# Altium schematic sheet CP2102N.SchDoc
size A3; SheetNumber: 3; SheetTotal: 7
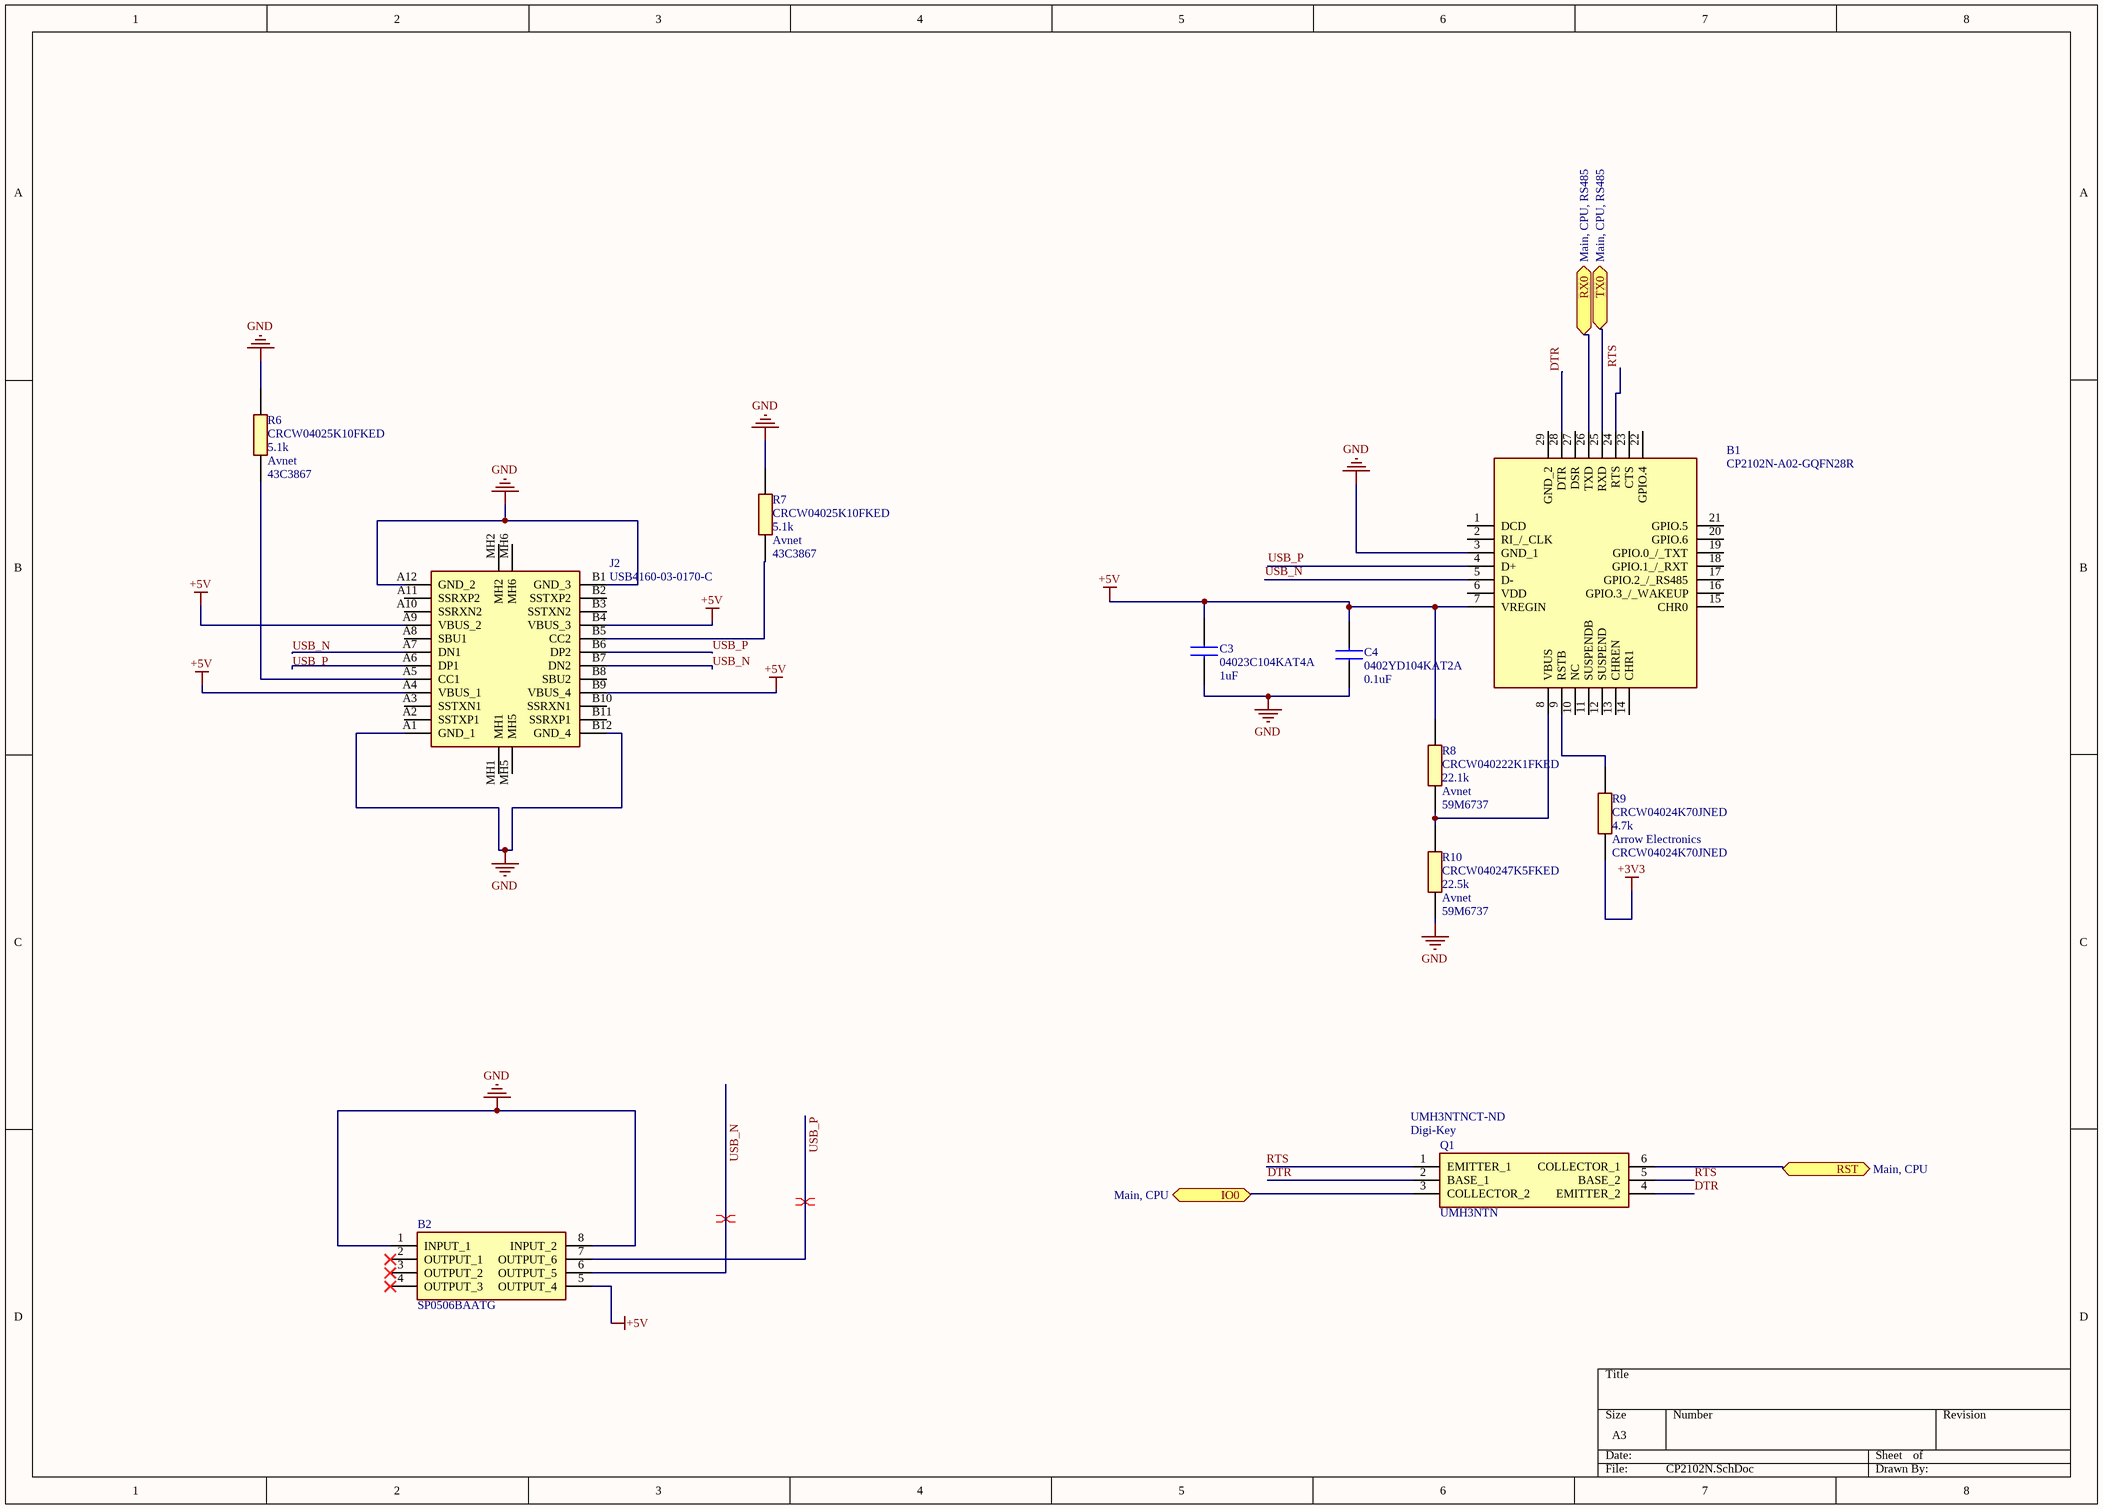
[diagram p0: CP2102N.SchDoc]

## Parts
B1  CP2102N-A02-GQFN28R  [QFN50P500X500X80-29N-D]
B2  SP0506BAATG  [SOP65P488X117-8N]
C3  04023C104KAT4A  value 1uF  [CAPC1005X40N]
C4  0402YD104KAT2A  value 0.1uF  [CAPC1005X40N]
J2  USB4160-03-0170-C  [USB4160030170C]
Q1  UMH3NTN  Supplier 1: Digi-Key  Supplier Part Number 1: UMH3NTNCT-ND  [UMH3NTN]
R6  CRCW04025K10FKED  value 5.1k  Supplier 1: Avnet  Supplier Part Number 1: 43C3867  [RESC1005X40N]
R7  CRCW04025K10FKED  value 5.1k  Supplier 1: Avnet  Supplier Part Number 1: 43C3867  [RESC1005X40N]
R8  CRCW040222K1FKED  value 22.1k  Supplier 1: Avnet  Supplier Part Number 1: 59M6737  [RESC1005X40N]
R9  CRCW04024K70JNED  value 4.7k  Supplier 1: Arrow Electronics  [RESC1005X40N]
R10  CRCW040247K5FKED  value 22.5k  Supplier 1: Avnet  Supplier Part Number 1: 59M6737  [RESC1005X40N]

## Ports
IO0 (bidir, see Main, CPU), RST (bidir, see Main, CPU), RX0 (bidir, see Main, CPU, RS485), TX0 (bidir, see Main, CPU, RS485)

## Nets
+3V3: R9.1
+5V: B1.7(VREGIN) B2.5(OUTPUT_4) C3.2 C4.2 J2.A4(VBUS_1) J2.A9(VBUS_2) J2.B4(VBUS_3) J2.B9(VBUS_4) R8.2
GND: B1.3(GND_1) B2.1(INPUT_1) B2.8(INPUT_2) C3.1 C4.1 J2.A1(GND_1) J2.A12(GND_2) J2.B1(GND_3) J2.B12(GND_4) R6.2 R7.2 R10.1
DTR: B1.28(DTR) Q1.2(BASE_1) Q1.4(EMITTER_2)
IO0: Q1.3(COLLECTOR_2) ; port IO0
RST: Q1.6(COLLECTOR_1) ; port RST
RTS: B1.24(RTS) Q1.1(EMITTER_1) Q1.5(BASE_2)
RX0: B1.26(TXD) ; port RX0
TX0: B1.25(RXD) ; port TX0
USB_N: B1.5(D-) B2.6(OUTPUT_5) J2.A7(DN1) J2.B7(DN2)
USB_P: B1.4(D+) B2.7(OUTPUT_6) J2.A6(DP1) J2.B6(DP2)
NetB1_8: B1.8(VBUS) R8.1 R10.2
NetB1_9: B1.9(RSTB) R9.2
NetJ2_A5: J2.A5(CC1) R6.1
NetJ2_B5: J2.B5(CC2) R7.1

Not connected (* = marked no-connect by the designer): B1 1(DCD) 2(RI_/_CLK) 6(VDD) 10(NC) 11(SUSPENDB) 12(SUSPEND) 13(CHREN) 14(CHR1) 15(CHR0) 16(GPIO.3_/_WAKEUP) 17(GPIO.2_/_RS485) 18(GPIO.1_/_RXT) 19(GPIO.0_/_TXT) 20(GPIO.6) 21(GPIO.5) 22(GPIO.4) 23(CTS) 27(DSR) 29(GND_2); B2 2(OUTPUT_1)* 3(OUTPUT_2)* 4(OUTPUT_3)*; J2 A2(SSTXP1) A3(SSTXN1) A8(SBU1) A10(SSRXN2) A11(SSRXP2) B2(SSTXP2) B3(SSTXN2) B8(SBU2) B10(SSRXN1) B11(SSRXP1) MH1 MH2 MH5 MH6

## Layout directives
differential pair: USB_N, USB_P

## Library data of the parts
B1 = CP2102N-A02-GQFN28R: USB Interface IC USB to UART bridge - QFN28; Manufacturer_Name: Silicon Labs; Geometry.Height: 0.8mm; Manufacturer_Part_Number: CP2102N-A02-GQFN28R; Mouser Part Number: 634-CP2102NA02QFN28R; Mouser Price/Stock: https://www.mouser.co.uk/ProductDetail/Silicon-Labs/CP2102N-A02-GQFN28R?qs=u16ybLDytRag4qKvSH3fTw%3D%3D; Arrow Part Number: CP2102N-A02-GQFN28R; Arrow Price/Stock: https://www.arrow.com/en/products/cp2102n-a02-gqfn28r/silicon-labs?region=nac; Datasheet Link: https://www.silabs.com/documents/public/data-sheets/cp2102n-datasheet.pdf
B2 = SP0506BAATG: TVS Diode Arrays; Manufacturer_Name: LITTELFUSE; Geometry.Height: 1.17mm; Mouser Part Number: 576-SP0506BAATG; Mouser Price/Stock: https://www.mouser.co.uk/ProductDetail/Littelfuse/SP0506BAATG?qs=RnOBYWd%2Fz7c6KTUitxDieg%3D%3D; Manufacturer_Part_Number: SP0506BAATG; Datasheet Link: https://www.littelfuse.com/~/media/electronics/datasheets/tvs_diode_arrays/littelfuse_tvs_diode_array_sp05_datasheet.pdf.pdf; Supplier 1: Arrow Electronics; Supplier Part Number 1: SP0506BAATG
C3 = 04023C104KAT4A: Multilayer Ceramic Capacitors MLCC - SMD/SMT 25V .1uF X7R 0402; Manufacturer_Name: AVX; Geometry.Height: 0.56mm; Mouser Part Number: 581-04023C104KAT4A; Mouser Price/Stock: https://www.mouser.co.uk/ProductDetail/AVX/0402YD104KAT2A?qs=fS3i9m8Z%2FmrV7G1UZb6Y7g%3D%3D; Manufacturer_Part_Number: 04023C104KAT4A; Datasheet Link: *; Supplier Part Number 1: 0402YD104KAT2A; Supplier 1: Avnet
C4 = 0402YD104KAT2A: Capacitor MLCC 0402 100nF 16V AVX 0402 Standard 100nF Ceramic Multilayer Capacitor, 16 V dc, +85C, X5R Dielectric, +/-10% SMD; Geometry.Height: 0.56mm; Mouser Part Number: 581-0402YD104K; Mouser Price/Stock: https://www.mouser.co.uk/ProductDetail/AVX/0402YD104KAT2A?qs=fS3i9m8Z%2FmrV7G1UZb6Y7g%3D%3D; Manufacturer_Name: AVX; Manufacturer_Part_Number: 0402YD104KAT2A; Datasheet Link: *; Supplier Part Number 1: 0402YD104KAT2A; Supplier 1: Avnet
J2 = USB4160-03-0170-C: USB Connectors USB-C Rec 3u" Vert 24P SMT 1.7mm TH stakes H7.46mm T+R+Cap; Manufacturer_Name: GCT (GLOBAL CONNECTOR TECHNOLOGY); Geometry.Height: 7.66mm; Mouser Part Number: 640-USB4160-3-0170-C; Mouser Price/Stock: https://www.mouser.co.uk/ProductDetail/GCT/USB4160-03-0170-C?qs=vvQtp7zwQdMCGQNngnxScA%3D%3D; Manufacturer_Part_Number: USB4160-03-0170-C; Datasheet Link: https://gct.co/Files/Drawings/USB4160.pdf?v=75f6cea7-84cd-41d4-89e8-137dc7b10777
Q1 = UMH3NTN: Bipolar Transistors - Pre-Biased DUAL NPN 50V 100MA SOT-363; Manufacturer_Name: ROHM Semiconductor; Geometry.Height: 1mm; Mouser Part Number: 755-UMH3NTN; Mouser Price/Stock: https://www.mouser.co.uk/ProductDetail/ROHM-Semiconductor/UMH3NTN?qs=4kLU8WoGk0st6ahJ6z2bmw%3D%3D; Manufacturer_Part_Number: UMH3NTN; Datasheet Link: https://componentsearchengine.com/Datasheets/2/UMH3NTN.pdf
R6 R7 = CRCW04025K10FKED: Thick Film Resistors - SMD 3/4watt 5.1Kohms 5%; Manufacturer_Name: Vishay; Geometry.Height: 0.4mm; Mouser Part Number: 71-CRCW0402-5.1K-E3; Mouser Price/Stock: https://www.mouser.co.uk/ProductDetail/Vishay-Dale/CRCW04024K70JNED?qs=iWCWVRvNViwY%252BotGHUbALg%3D%3D; Manufacturer_Part_Number: CRCW04025K10FKED; Datasheet Link: http://www.vishay.com/docs/20035/dcrcwe3.pdf
R8 = CRCW040222K1FKED: Résistances à couches épaisses - CMS 1/16watt 22.1Kohms 1%; Manufacturer_Name: Vishay; Geometry.Height: 0.4mm; Mouser Part Number: 71-CRCW0402-22.1K-E3; Mouser Price/Stock: https://www.mouser.co.uk/ProductDetail/Vishay-Dale/CRCW04024K70JNED?qs=iWCWVRvNViwY%252BotGHUbALg%3D%3D; Manufacturer_Part_Number: CRCW040222K1FKED; Datasheet Link: http://www.vishay.com/docs/20035/dcrcwe3.pdf
R9 = CRCW04024K70JNED: VISHAY - CRCW04024K70JNED - RES, THICK FILM, 4K7, 5%, 0.063W, 0402; Geometry.Height: 0.4mm; Mouser Part Number: 71-CRCW0402J-4.7K-E3; Mouser Price/Stock: https://www.mouser.co.uk/ProductDetail/Vishay-Dale/CRCW04024K70JNED?qs=iWCWVRvNViwY%252BotGHUbALg%3D%3D; Manufacturer_Name: Vishay; Manufacturer_Part_Number: CRCW04024K70JNED; Datasheet Link: http://www.vishay.com/docs/20035/dcrcwe3.pdf; Supplier Part Number 1: CRCW04024K70JNED
R10 = CRCW040247K5FKED: Résistances à couches épaisses - CMS 1/16watt 47.5Kohms 1%; Manufacturer_Name: Vishay; Geometry.Height: 0.4mm; Mouser Part Number: 71-CRCW0402-47.5K-E3; Mouser Price/Stock: https://www.mouser.co.uk/ProductDetail/Vishay-Dale/CRCW04024K70JNED?qs=iWCWVRvNViwY%252BotGHUbALg%3D%3D; Manufacturer_Part_Number: CRCW040247K5FKED; Datasheet Link: http://www.vishay.com/docs/20035/dcrcwe3.pdf